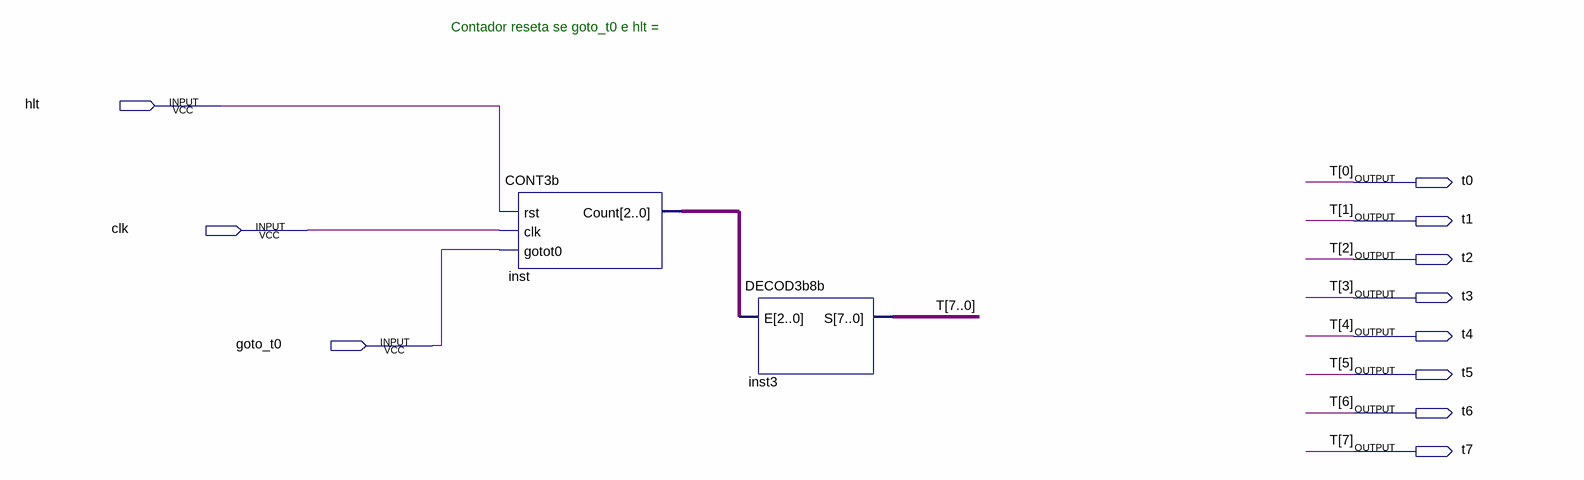
[diagram p0: schematic sheet]
// Quartus schematic TEMPORIZADOR.bdf as structural Verilog: 2 symbols, 11 pins
module TEMPORIZADOR (
  input  hlt,
  input  clk,
  input  goto_t0,
  output t0,
  output t1,
  output t2,
  output t3,
  output t4,
  output t5,
  output t6,
  output t7
);

  wire [2:0] inst_count;

  CONT3b inst (.rst(hlt), .clk(clk), .gotot0(goto_t0), .Count(inst_count));
  DECOD3b8b inst3 (.E(inst_count), .S({t7, t6, t5, t4, t3, t2, t1, t0}));

  // Notes on the sheet:
  //   Contador reseta se goto_t0 e hlt = 
endmodule
